# EAGLE design OpenChargeport_SI4010 (EAGLE 6.2)
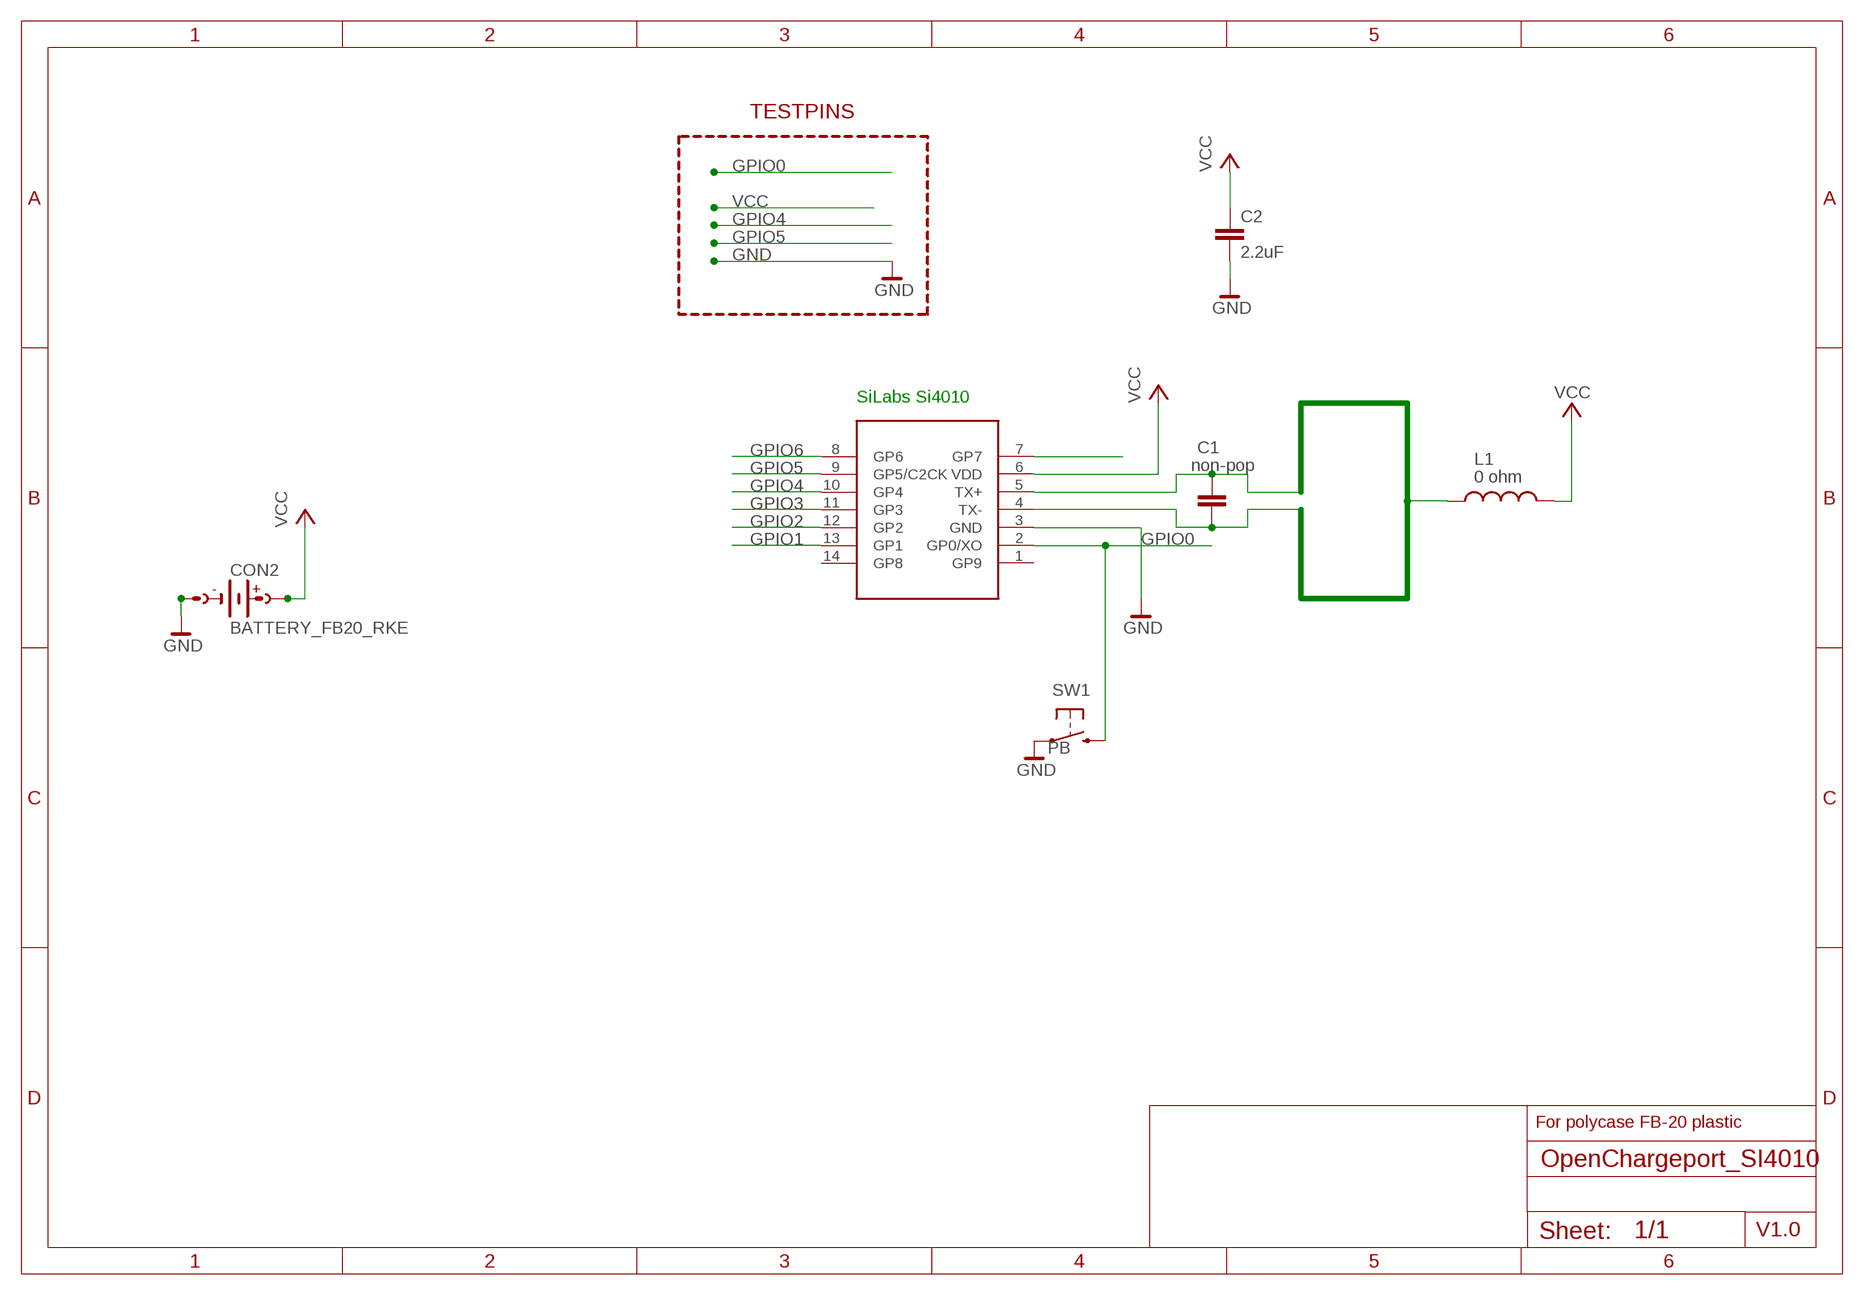
[diagram p0: schematic, sheet 1]

## Parts
C1  non-pop  C-EUC0603K  [C0603K]
C2  2.2uF  C-EUC0805K  [C0805K]
CON2  BATTERY_FB20_RKE  BATTERY_FB20_RKEFB20  [BATTERY_HOLDER_CR2032F_RKE_FB20]
IC1  SI4010  SI4010SOIC-14  [SOIC-14]
L1  0 ohm  INDUCTL0402  [L0402]
SW1  PB  PUSHBUTTON1PILL  [PUSHB_PILL]

## Nets
ANT: C1.1 C1.2 IC1.4(TX-) IC1.5(TX+) L1.1
GND: C2.2 CON2.MINUS1(NEG1) CON2.MINUS(NEG) IC1.3(GND) SW1.P$1
GPIO0: IC1.2(GP0/XO) SW1.P$2
GPIO1: IC1.13(GP1)
GPIO2: IC1.12(GP2)
GPIO3: IC1.11(GP3)
GPIO4: IC1.10(GP4)
GPIO5: IC1.9(GP5/C2CK)
GPIO6: IC1.8(GP6)
N$5: IC1.7(GP7)
VCC: C2.1 CON2.PLUS1(POS) CON2.PLUS2(POS1) IC1.6(VDD) L1.2
Unconnected: IC1.1(GP9) IC1.14(GP8)

## Notes on the sheet
- TESTPINS
- SiLabs Si4010
- For polycase FB-20 plastic
- V1.0

## Library data of the parts
C1 C2 = rcl:C-EU: CAPACITOR, European symbol
CON2 = dzo:BATTERY_FB20_RKE
IC1 = dzo:SI4010
L1 = lve_modified_by_dzo:INDUCT
SW1 = dzo:PUSHBUTTON1

## Board
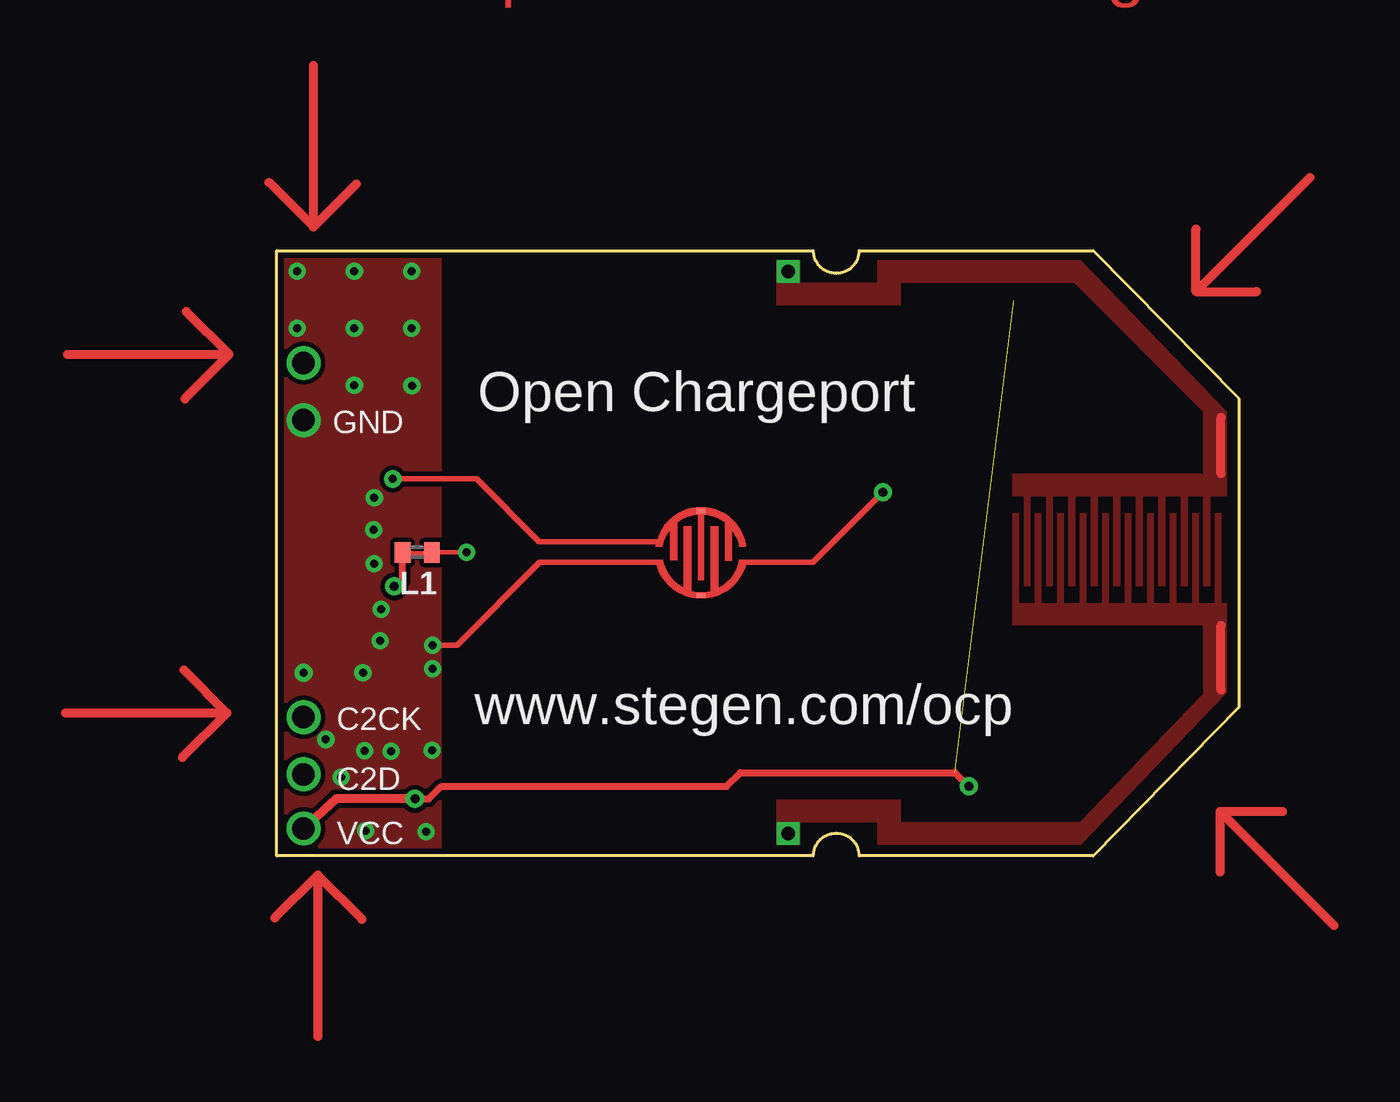
[diagram p1: board, top side]
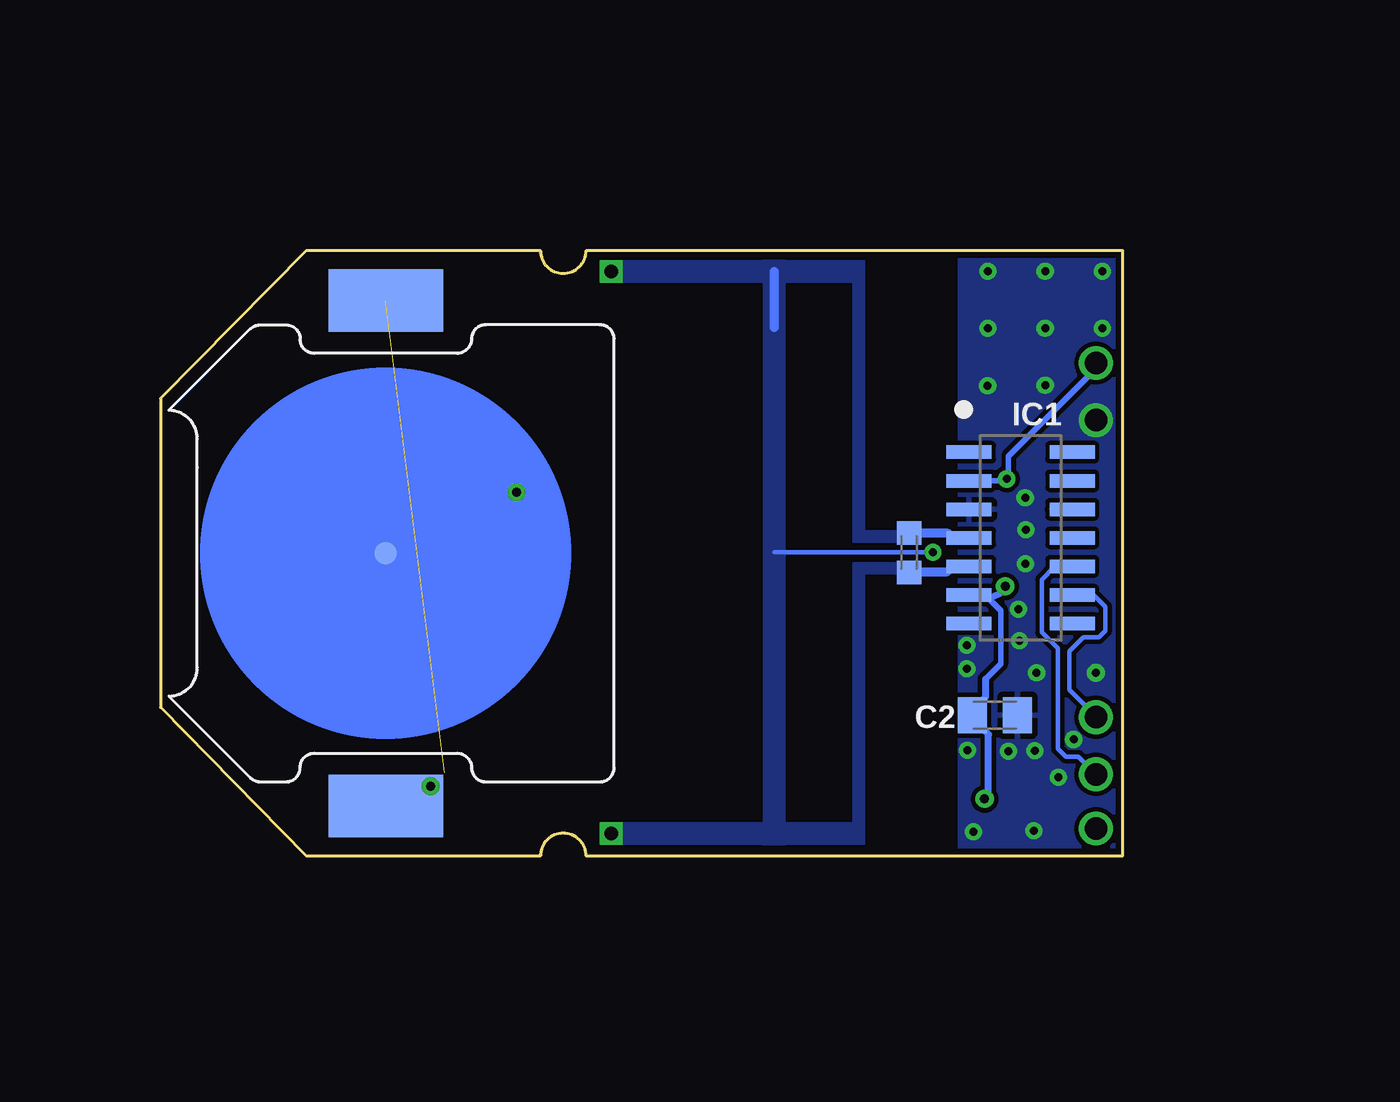
[diagram p2: board, bottom side, seen from below]

Size 42.8 x 26.92 mm. Coordinates in mm from the lower left corner, seen from the top.
Outline: 0,0 0,26.92 23.88,26.92 arc180 25.91,26.92 36.32,26.92 42.8,20.34 42.8,6.6 36.32,0 25.91,0 arc180 23.88,0 0,0
Copper layers (1*16): Top 0.035mm / dielectric 1.5mm / Bottom 0.035mm
Design rules: minimum track width 6mil, minimum drill 14mil, track to track 8mil, track to pad 8mil, pad to pad 8mil, via to via 8mil, smd to smd 8mil, copper to edge 10mil, drill to drill 8mil, minimum pad ring 10mil, minimum via ring 8mil, stop-mask expansion 4mil, vias tented up to drill 25mil, thermal gap 10mil
bKeepout: 1 lines

### Footprints (pad centres in the part's own frame; a part is rotated, then mirrored left to right if it is on the bottom)
C0603K = smd 1.05 x 1.08: 1 -0.875,0; 2 0.875,0
C0805K = smd 1.3 x 1.6: 1 -1,0; 2 1,0
BATTERY_HOLDER_CR2032F_RKE_FB20 = smd 1 x 1: MINUS 0,0; MINUS1 0,0 | smd 2.794 x 5.08: PLUS1 -11.239,0; PLUS2 11.239,0
SOIC-14 = smd 0.6 x 2: 1 -3.81,-2.295; 2 -2.54,-2.295; 3 -1.27,-2.295; 4 0,-2.295; 5 1.27,-2.295; 6 2.54,-2.295; 7 3.81,-2.295; 8 3.81,2.295; 9 2.54,2.295; 10 1.27,2.295; 11 0,2.295; 12 -1.27,2.295; 13 -2.54,2.295; 14 -3.81,2.295
L0402 = smd 0.7 x 0.9: 1 -0.65,0; 2 0.65,0
PUSHB_PILL = smd 0.406 x 0.203: P$1 0.011,-1.896; P$2 0.004,1.861

### Placement (x,y rotation side)
C1  9.5,13.49 270 bottom
C2  5.69,6.25 0 bottom
CON2  32.78,13.46 90 bottom
IC1  4.55,14.14 270 bottom
L1  6.25,13.5 180 top
SW1  18.86,13.48 0 top

### Tracks (layer width: path | path; a pad name or v marks a point on that pad's centre or on a via)
ANT  (via drill 0.36, 0.6)
  Top 0.203: L1.1 v8.45,13.5
  Top 0.406: 42,7.38 42,10.25 | 42,17 42,19.5
  Bottom 0.203: v8.45,13.5 15.5,13.5
  Bottom 0.254: 9.27,14.15 9.35,14.15 C1.1
  Bottom 0.406: IC1.4 7.57,14.15 7.77,14.35 9.07,14.35 9.27,14.15 9.25,14.15 | IC1.5 7.54,12.88 7.85,12.62 9.04,12.62 9.27,12.85 9.35,12.85 | 15.5,23.5 15.5,26
  other vias: 22.75,26 22.75,1
  pour Bottom (no thermals): 12,13.95 12,25.5 23.25,25.5 23.25,26.5 11.5,26.5 11.5,13.95
  pour Bottom (no thermals): 9,14.45 12,14.45 12,13.95 9,13.95
  pour Top (no thermals): 23.25,25.5 26.75,25.5 26.75,26.5 35.75,26.5 42.25,19.75 42.25,18.75 35.5,25.5 27.75,25.5 27.75,24.5 22.25,24.5 22.25,26.5 23.25,26.5
  pour Top (no thermals): 32.75,17 41.25,17 41.25,19.75 42.25,19.75 42.25,16.19 42.25,16.06 42.25,16 41.5,16 41.5,12 41.25,12 41.25,16 40.5,16 40.5,12 40.25,12 40.25,16 39.5,16 39.5,12 39.25,12 39.25,16 38.5,16 38.5,12 38.25,12 38.25,16 37.5,16 37.5,12 37.25,12 37.25,16 36.5,16 36.5,12 36.25,12 36.25,16 35.5,16 35.5,12 35.25,12 35.25,16 34.5,16 34.5,12 34.25,12 34.25,16 33.5,16 33.5,12 33.25,12 33.25,16 32.75,16
  pour Top (no thermals): 41.25,7.25 41.25,10.25 32.75,10.25 32.75,15.25 33,15.25 33,11.25 33.75,11.25 33.75,15.25 34,15.25 34,11.25 34.75,11.25 34.75,15.25 35,15.25 35,11.25 35.75,11.25 35.75,15.25 36,15.25 36,11.25 36.75,11.25 36.75,15.25 37,15.25 37,11.25 37.75,11.25 37.75,15.25 38,15.25 38,11.25 38.75,11.25 38.75,15.25 39,15.25 39,11.25 39.75,11.25 39.75,15.25 40,15.25 40,11.25 40.75,11.25 40.75,15.25 41,15.25 41,11.25 41.75,11.25 41.75,15.25 42,15.25 42,11.25 42.25,11.25 42.25,7.25
  pour Top (no thermals): 22.25,2.5 27.75,2.5 27.75,1.5 35.75,1.5 42.25,8.25 42.25,7.25 35.75,0.5 26.75,0.5 26.75,1.5 23.25,1.5 23.25,0.5 22.25,0.5
  pour Bottom (no thermals): 11.5,13.05 11.5,0.5 23.25,0.5 23.25,1.5 12,1.5 12,13.05
  pour Bottom (no thermals): 15,26.5 16,26.5 16,0.5 15,0.5
  pour Bottom (no thermals): 9,13.05 12,13.05 12,12.55 9,12.55
GND  (via drill 0.36, 0.36 pad 0.76, 0.36 pad 0.81, 0.4, 1)
  Top 0.1: 18.88,11.61 SW1.P$1
  Top 0.102: 20.75,13.06 20.37,12.27 19.71,11.73 SW1.P$1 | 18.88,11.61 17.73,11.94 17.04,13.06
  Top 0.254: v6.93,9.37 v6.94,9.38 8.02,9.38 11.69,13.06 17.04,13.06 | 20.75,13.06 23.85,13.06 v26.98,16.18
  Bottom 0.203: 6.86,8.18 7.01,8.03 | CON2.MINUS1 29.69,13.46 v26.98,16.18
  Bottom 0.254: 7.74,15.41 IC1.3
  Bottom 0.305: IC1.3 6.99,15.27
  other vias: 1.19,19.38 0.91,26.01 3.45,26.01 5.99,26.01 3.45,23.47 5.99,23.47 0.91,23.47 3.84,8.15 3.45,20.93 3.96,1.12 6.01,20.92 6.65,1.08 4.65,10.97 4.33,13 4.32,14.51 4.34,15.93 1.19,8.15 6.91,4.7 5.08,4.67 3.91,4.67 4.6,9.58 6.93,8.33 2.87,3.51 2.18,5.18
  pour Bottom: 7.25,27 7.25,0 0,0 0,27
  pour Top: 7.25,27 7.25,0 0,0 0,27
GPIO0  (via drill 0.36, 1)
  Top 0: 17.05,14 arc90 17.27,14.21 17.27,14.73 arc-90 17.28,14.74 17.49,14.74 arc-90 17.82,15.08 17.88,15.08 arc-90 18,15.2 18.16,15.2 arc-90 18.31,15.35 SW1.P$2
  Top 0.254: v5.17,16.77 8.88,16.77 11.67,13.98 17.04,13.98 17.05,14
  Bottom 0.203: IC1.2 6.33,16.68
  Bottom 0.254: 6.25,16.76 6.33,16.68 | IC1.2 5.35,16.68 v5.17,16.77 5.08,16.85 5.08,17.78 1.52,21.34 1.52,21.6 v1.2,21.93
GPIO2
  Bottom 0.203: 2.92,15.41 IC1.12 | 2.92,15.41 3.17,15.41 | 3.02,15.39 2.92,15.41
GPIO3
  Bottom 0.203: 3.02,14.12 2.22,14.12 IC1.11
GPIO4  (via drill 1)
  Bottom 0.203: IC1.10 2.28,12.85 3.05,12.85 3.61,12.29 3.61,9.96 2.9,9.25 2.9,4.78 2.54,4.42 1.98,4.42 v1.19,3.63
GPIO5  (via drill 1)
  Bottom 0.203: IC1.9 1.36,11.61 1.36,11.6 1.29,11.6 0.77,11.08 0.77,10.03 1.07,9.73 1.75,9.73 2.38,9.1 2.38,7.39 1.07,6.08 v1.19,6.17
  Bottom 0.254: IC1.9
N$1
  Top 0.203: 6.89,13.47 5.71,13.47
S$1
  Top 0.406: 40.89,25.09 45.97,30.18 | 40.89,25.09 40.89,27.89 40.89,25.09 | 40.89,25.09 43.59,25.09
S$2
  Top 0.406: 41.96,1.98 47.04,-3.1 | 41.96,1.98 44.76,1.98 41.96,1.98 | 41.96,1.98 41.96,-0.71
S$3
  Top 0.406: 1.63,27.98 1.63,35.16 | 1.63,27.98 -0.34,29.95 1.63,27.98 | 1.63,27.98 3.54,29.88
S$4
  Top 0.406: 1.82,-0.85 1.82,-8.03 | 1.82,-0.85 3.8,-2.82 1.82,-0.85 | 1.82,-0.85 -0.08,-2.75
S$5
  Top 0.406: -9.3,22.31 -2.12,22.31 | -2.12,22.31 -4.09,20.33 -2.12,22.31 | -2.12,22.31 -4.02,24.21
S$6
  Top 0.406: -2.22,6.36 -9.4,6.36 | -2.22,6.36 -4.2,4.38 -2.22,6.36 | -2.22,6.36 -4.12,8.26
VCC  (via drill 0.4, 1)  (1 unrouted)
  Top 0.305: v30.79,3.1 30.18,3.71 20.62,3.71 20.02,3.1 7.32,3.1 6.76,2.54 v6.15,2.54 | L1.2 5.6,12.24 v5.23,11.99
  Top 0.406: v6.15,2.54 2.64,2.54 v1.19,1.22
  Bottom 0.254: IC1.6 6.02,11.61 5.94,11.53 | 5.89,11.48 5.89,11.38 5.42,10.91 5.42,8.55 6.1,7.87
  Bottom 0.305: 6.92,11.53 IC1.6 | v5.23,11.99 5.38,11.73 5.89,11.48 5.94,11.53 | 6.1,7.87 6.1,7.06 6.44,6.78 C2.1 6.46,5.92 5.97,5.41 5.97,2.72 v6.15,2.54
  Bottom 0.406: CON2.PLUS1 30.79,2.22 v30.79,3.1

### Text on the board
Top: Possible positions of PCB edge TABs!
tPlace: Open Chargeport | GND | C2CK | www.stegen.com/ocp | C2D | VCC